# EAGLE design imu (EAGLE 6.5.0)
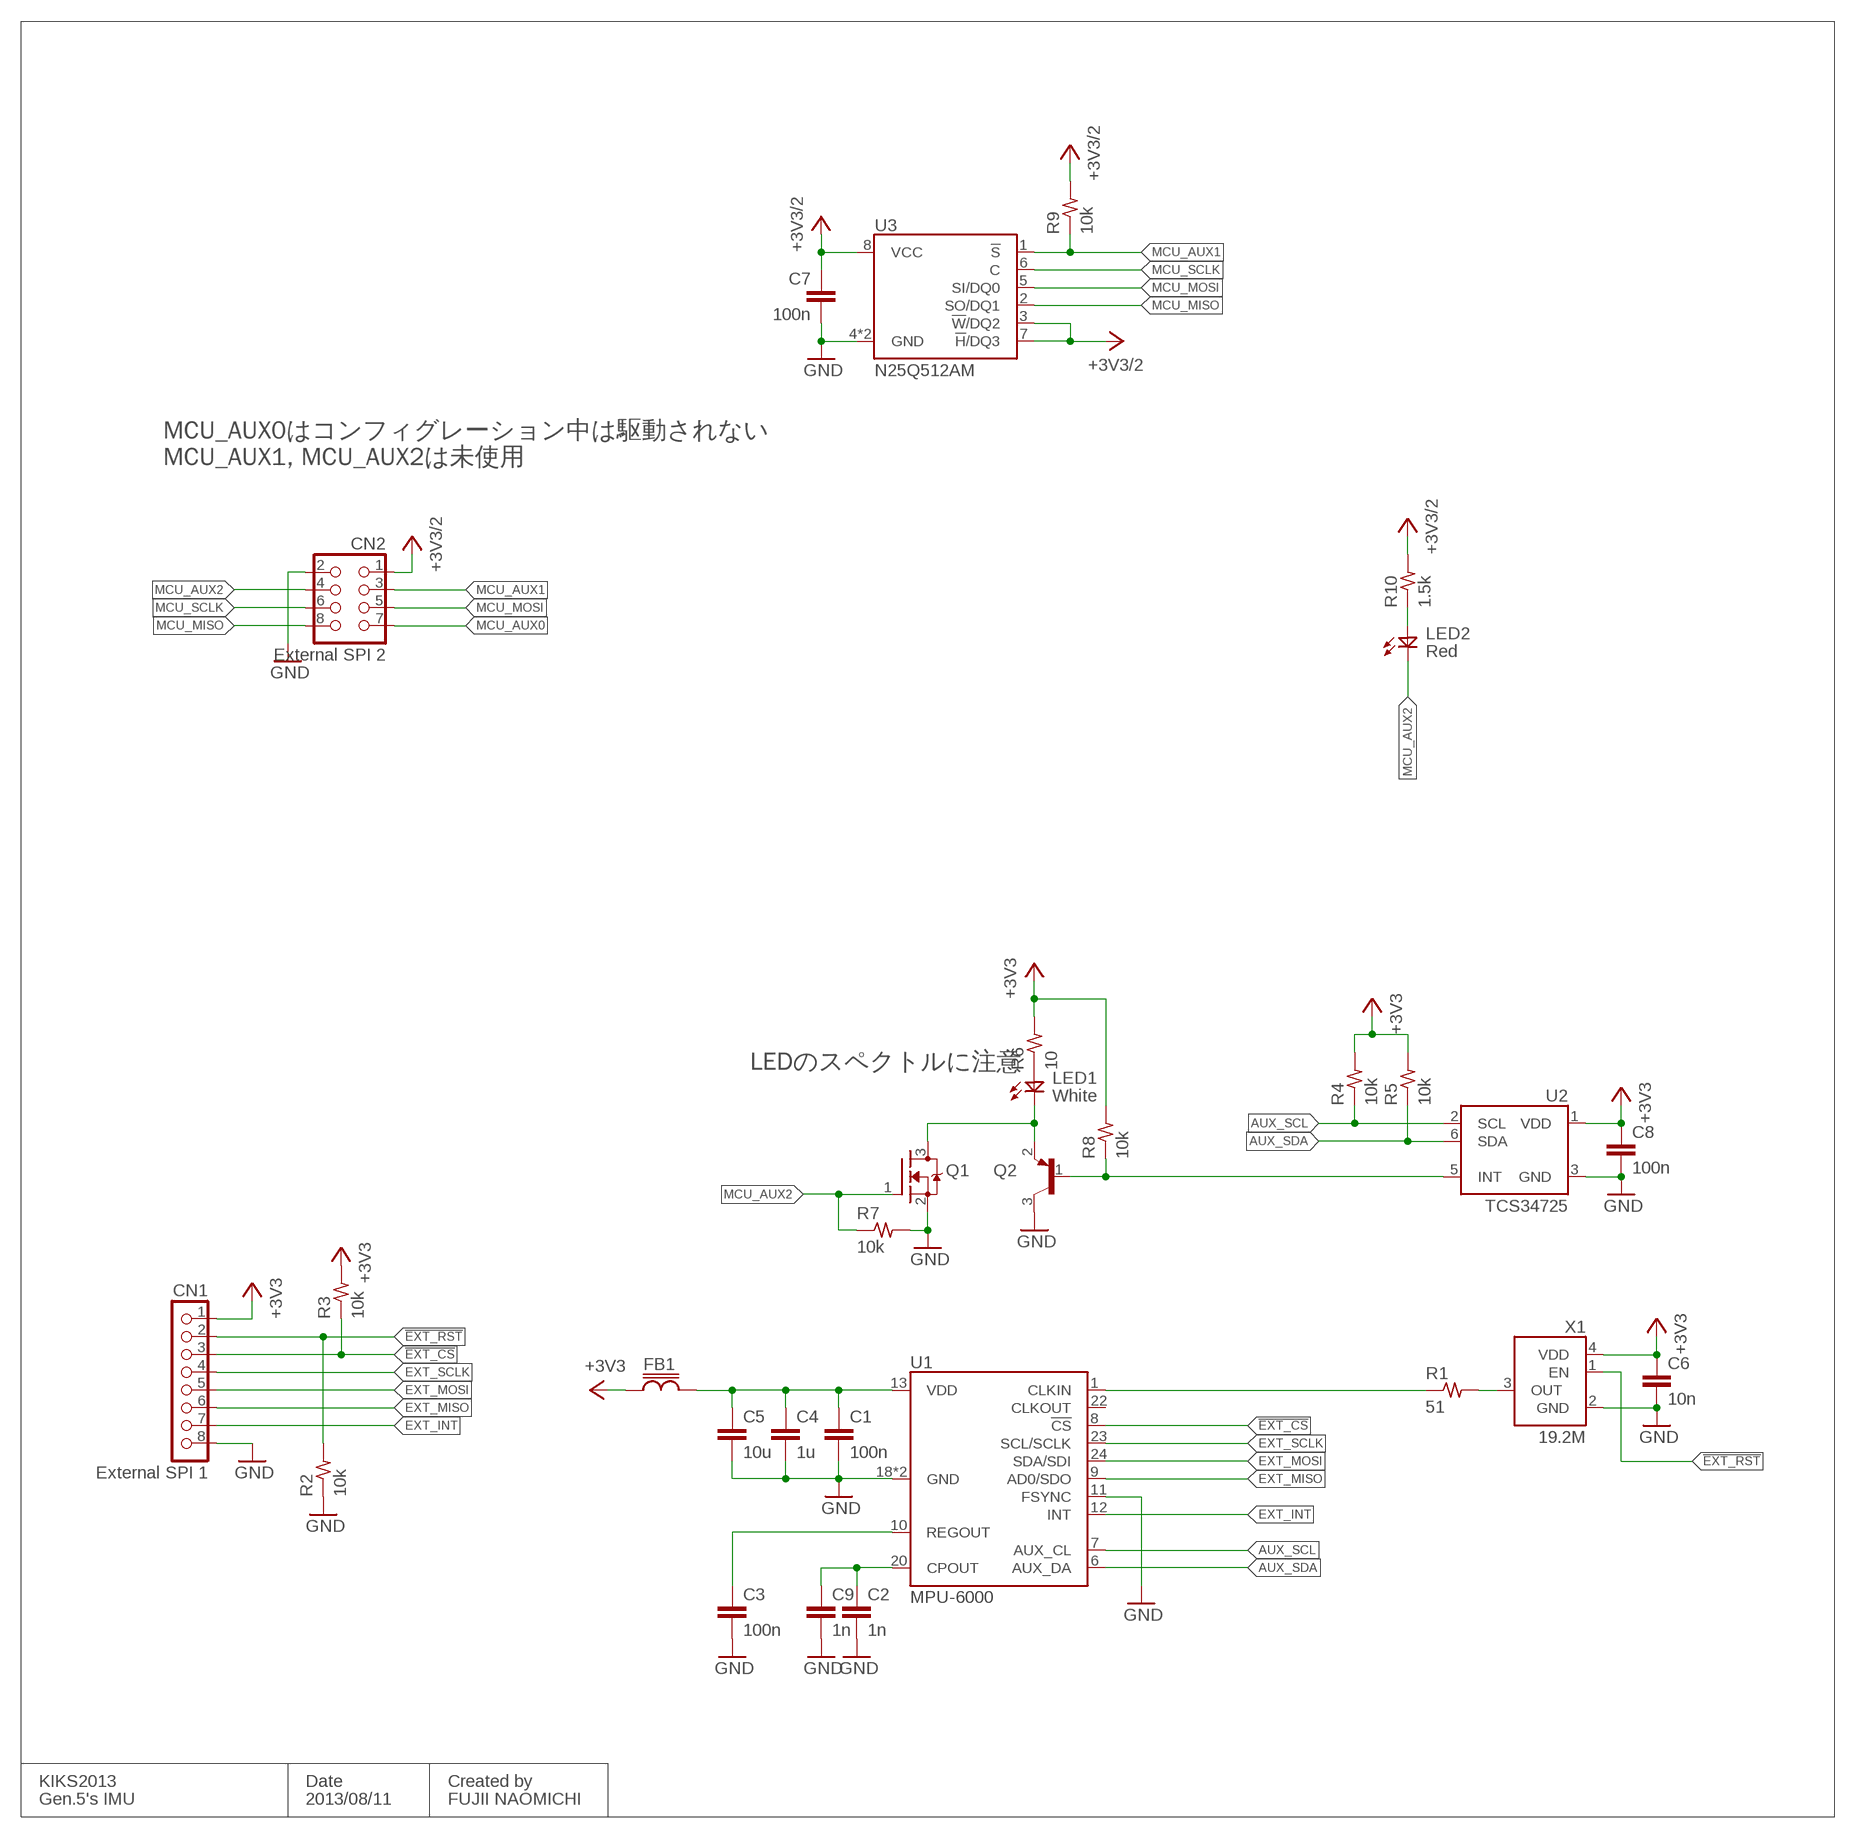
[diagram p0: schematic, sheet 1]

## Parts
C1  100n  C1005  [1005]
C2  1n  C1005  [1005]
C3  100n  C1005  [1005]
C4  1u  C1005  [1005]
C5  10u  C1005  [1005]
C6  10n  C1005  [1005]
C7  100n  C1005  [1005]
C8  100n  C1005  [1005]
C9  1n  C1005  [1005]
CN1  External SPI 1  PIN1X8  [PIN1X8]
CN2  External SPI 2  PIN2X4  [PIN2X4]
FB1  FB1608  [1608]
LED1  White  LED1608  [1608]
LED2  Red  LED1608  [1608]
Q1  MOS-N-SOT23  [SOT23-3]
Q2  PNP-SOT23  [SOT23-3]
R1  51  R1005  [1005]
R2  10k  R1005  [1005]
R3  10k  R1005  [1005]
R4  10k  R1005  [1005]
R5  10k  R1005  [1005]
R6  10  R1608  [1608]
R7  10k  R1005  [1005]
R8  10k  R1005  [1005]
R9  10k  R1005  [1005]
R10  1.5k  R1005  [1005]
U1  MPU-6000  [QFN24-0.5]
U2  TCS34725  [FN-6]
U3  N25Q512AM  [DFN8-1.27]
X1  19.2M  ASDMB  [OSC2520]

## Nets
!EXT_CS: CN1.3 R3.1 U1.8(!CS)
!EXT_RST: CN1.2 R2.2 X1.1(EN)
+3V3: C6.1 C8.1 CN1.1 FB1.1 R3.2 R4.2 R5.2 R6.2 R8.2 U2.1(VDD) X1.4(VDD)
+3V3/2: C7.1 CN2.1 R9.2 R10.2 U3.3(!W!/DQ2) U3.7(!H!/DQ3) U3.8(VCC)
AUX_SCL: R4.1 U1.7(AUX_CL) U2.2(SCL)
AUX_SDA: R5.1 U1.6(AUX_DA) U2.6(SDA)
EXT_INT: CN1.7 U1.12(INT)
EXT_MISO: CN1.6 U1.9(AD0/SDO)
EXT_MOSI: CN1.5 U1.24(SDA/SDI)
EXT_SCLK: CN1.4 U1.23(SCL/SCLK)
GND: C1.2 C2.2 C3.2 C4.2 C5.2 C6.2 C7.2 C8.2 C9.2 CN1.8 CN2.2 Q1.2(S) Q2.3(C) R2.1 R7.2 U1.11(FSYNC) U1.18(GND) U1.PAD(GND) U2.3(GND) U3.4(GND) U3.PAD(GND) X1.2(GND)
MCU_AUX0: CN2.7
MCU_AUX1: CN2.3 R9.1 U3.1(!S)
MCU_AUX2: CN2.4 LED2.K Q1.1(G) R7.1
MCU_MISO: CN2.8 U3.2(SO/DQ1)
MCU_MOSI: CN2.5 U3.5(SI/DQ0)
MCU_SCLK: CN2.6 U3.6(C)
N$1: C2.1 C9.1 U1.20(CPOUT)
N$2: C3.1 U1.10(REGOUT)
N$3: C1.1 C4.1 C5.1 FB1.2 U1.13(VDD)
N$4: R1.2 X1.3(OUT)
N$5: R1.1 U1.1(CLKIN)
N$6: LED1.A R6.1
N$7: Q2.1(B) R8.1 U2.5(INT)
N$8: LED1.K Q1.3(D) Q2.2(E)
N$9: LED2.A R10.1
Unconnected: U1.22(CLKOUT)

## Notes on the sheet
- MCU_AUX0はコンフィグレーション中は駆動されない
  MCU_AUX1, MCU_AUX2は未使用
- LEDのスペクトルに注意
- KIKS2013 | Date | Created by
- Gen.5's IMU | 2013/08/11 | FUJII NAOMICHI

## Library data of the parts
C1-C9 = Passive:C
CN1 = Connector:PIN1X8
CN2 = Connector:PIN2X4
FB1 = Passive:FB
LED1 LED2 = Opto:LED
Q1 = Transistor:MOS-N-*
Q2 = Transistor:PNP-
R1-R10 = Passive:R
U1 = ic-Invensense:MPU-6000
U2 = ic-ams:TCS3472; ADDRESS: 0x29; BUS: VDD
U3 = ic-Micron:N25Q512A
X1 = Oscillator:ASDM

## Board
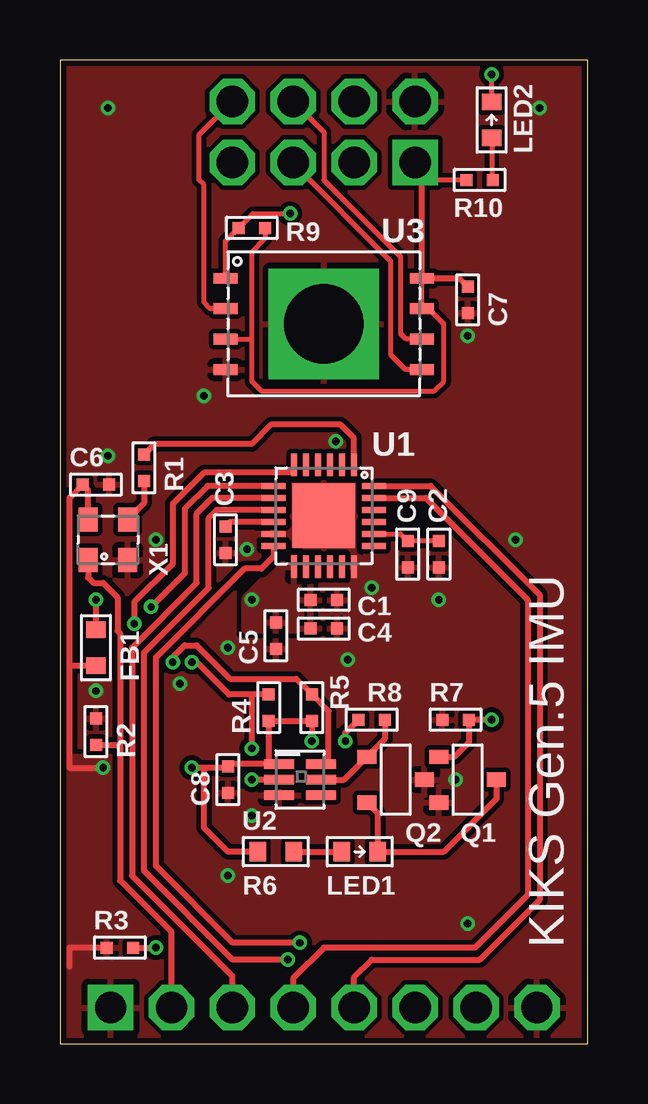
[diagram p1: board, top side]
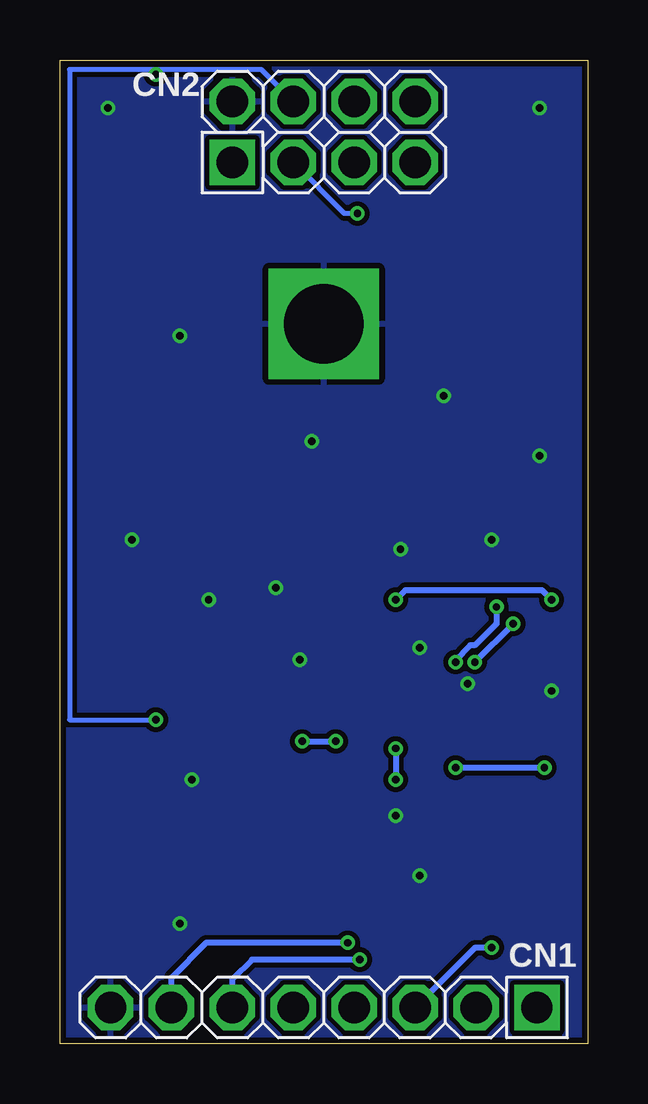
[diagram p2: board, bottom side, seen from below]

Size 22 x 41 mm. Coordinates in mm from the lower left corner, seen from the top.
Outline: 0,0 22,0 22,41 0,41 0,0
Copper layers (1*16): Top 0.035mm / dielectric 1.6mm / Bottom 0.035mm
Design rules "FusionPCB": minimum track width 6mil, minimum drill 0.3mm, track to track 6mil, track to pad 6mil, pad to pad 6mil, via to via 6mil, smd to smd 6mil, copper to edge 10mil, drill to drill 10mil, minimum pad ring 0.2mm, minimum via ring 6mil, stop-mask expansion 4mil, vias tented up to drill 3mm, thermal gap 10mil

### Footprints (pad centres in the part's own frame; a part is rotated, then mirrored left to right if it is on the bottom)
1005 = smd 0.5 x 0.5: 1 -0.55,0; 2 0.55,0
PIN1X8 = drill 1.3 pad 1.9 square: 1 -8.89,0 | drill 1.3 pad 1.9 octagon: 2 -6.35,0; 3 -3.81,0; 4 -1.27,0; 5 1.27,0; 6 3.81,0; 7 6.35,0; 8 8.89,0
PIN2X4 = drill 1.3 square: 1 -3.81,-1.27 | drill 1.3 octagon: 2 -3.81,1.27; 3 -1.27,-1.27; 4 -1.27,1.27; 5 1.27,-1.27; 6 1.27,1.27; 7 3.81,-1.27; 8 3.81,1.27
1608 = smd 0.7 x 0.8: 1 -0.75,0; 2 0.75,0
1608' = smd 0.7 x 0.8: A 0.75,0; K -0.75,0
SOT23-3 = smd 0.6 x 0.8: 1 -0.95,-1.2; 2 0.95,-1.2; 3 0,1.2
QFN24-0.5 = smd 0.95 x 0.25: 1 -2.125,1.25; 2 -2.125,0.75; 3 -2.125,0.25; 4 -2.125,-0.25; 5 -2.125,-0.75; 6 -2.125,-1.25; 13 2.125,-1.25; 14 2.125,-0.75; 15 2.125,-0.25; 16 2.125,0.25; 17 2.125,0.75; 18 2.125,1.25 | smd 0.25 x 1: 7 -1.25,-2.1; 8 -0.75,-2.1; 9 -0.25,-2.1; 10 0.25,-2.1; 11 0.75,-2.1; 12 1.25,-2.1; 19 1.25,2.1; 20 0.75,2.1; 21 0.25,2.1; 22 -0.25,2.1; 23 -0.75,2.1; 24 -1.25,2.1 | smd 2.7 x 2.6: PAD 0,0
FN-6 = smd 0.4 x 1.25: 1 -0.65,-0.875; 2 0,-0.875; 3 0.65,-0.875; 4 0.65,0.875; 5 0,0.875; 6 -0.65,0.875
DFN8-1.27 = smd 0.44 x 1: 1 -1.905,-4.1; 2 -0.635,-4.1; 3 0.635,-4.1; 4 1.905,-4.1; 5 1.905,4.1; 6 0.635,4.1; 7 -0.635,4.1; 8 -1.905,4.1 | drill 3.3 pad 4.6 square: PAD 0,0
OSC2520 = smd 0.8 x 1: 1 -0.825,-0.85; 2 0.825,-0.85; 3 0.825,0.85; 4 -0.825,0.85

### Placement (x,y rotation side)
C1  11,18.5 0 top
C2  15.8,20.4 270 top
C3  6.9,21 270 top
C4  11,17.3 0 top
C5  9,17 270 top
C6  1.5,23.3 0 top
C7  17,31 270 top
C8  7,11 270 top
C9  14.5,20.4 270 top
CN1  11,1.5 180 bottom
CN2  11,38 0 bottom
FB1  1.5,16.5 90 top
LED1  White  [1608']  12.5,8 180 top
LED2  Red  [1608']  18,38.5 270 top
Q1  17,11 270 top
Q2  14,11 270 top
R1  3.5,24 270 top
R2  1.5,13 270 top
R3  2.5,4 180 top
R4  8.7,14 270 top
R5  10.5,14 270 top
R6  9,8 180 top
R7  16.5,13.5 180 top
R8  13,13.5 180 top
R9  8,34 0 top
R10  17.5,36 180 top
U1  11,22 270 top
U2  10,11 270 top
U3  11,30 270 top
X1  2,21 0 top

### Tracks (layer width: path | path; a pad name or v marks a point on that pad's centre or on a via)
!EXT_CS  (via drill 0.3)
  Top 0.25: U1.8 6.35,22.75 5.7,22.1 5.7,19.2 3,16.5 3,7 7.19,2.81 CN1.3 | R3.1 v4,4
  Bottom 0.25: v4,4 4.69,4 CN1.3
!EXT_RST
  Top 0.25: 2.5,12.45 2.5,17.1 2.4,17.2 2.4,18.6 1.8,19.2 1.4,19.2 1.18,19.43 X1.1 | 2.5,12.45 2.5,6.8 4.65,4.65 CN1.2 | R2.2 2.5,12.45
+3V3  (via drill 0.3)
  Top 0.25: 0.4,3.21 0.4,4 R3.2 | 0.4,15.75 0.4,11.5 v1.8,11.5 | 0.4,15.75 0.4,22.75 C6.1 1.18,23.07 X1.4 | FB1.1 0.4,15.75 | 8.7,11.65 7.1,11.65 C8.1 6.95,11.5 6,11.5 | R6.2 7,8 6,9 6,11.5 | 8.7,11.65 R4.2 R5.2 v10.5,12.6 | 8.7,11.65 U2.1 | 6,11.5 v5.5,11.5 | v11.9,12.6 11.9,12.95 R8.2
  Bottom 0.25: v1.8,11.5 v5.5,11.5 | v11.9,12.6 v10.5,12.6
  pour Top (isolate 0.2): -3,12 3,12 3,8 5,6 5,-3 -3,-3
+3V3/2
  Top 0.2: U3.8 U3.7 15.37,30.64 16,30 16,27.6 15.6,27.2 8.4,27.2 8,27.6 8,29.36 | 8,29.36 8,33 8.55,33.55 R9.2 | U3.3 8,29.36 | R10.2 15.54,36 CN2.1
  Top 0.25: CN2.1 15.1,36.44 U3.8 16.64,31.91 C7.1
AUX_SCL  (via drill 0.3)
  Top 0.25: U1.7 6.15,23.25 5.2,22.3 5.2,19.6 v3.8,18.2 | 8.2,11 v8,11 U2.2 | v5.5,15.9 5.7,15.9 7.05,14.55 8,14.55 | R4.1 8,14.55 | v8,12.3 8,14.55
  Bottom 0.25: v3.8,18.2 3.8,17.5 4.7,16.6 4.9,16.6 5.5,16 v5.5,15.9 | v8,12.3 v8,11
AUX_SDA  (via drill 0.3)
  Top 0.25: U1.6 9.75,23.8 6,23.8 4.7,22.5 4.7,20 3.1,18.4 v3.1,17.5 | v4.7,15.9 4.7,16.1 5.2,16.6 5.7,16.6 7.1,15.2 9.85,15.2 R5.1 11.2,13.85 11.2,11.65 U2.6
  Bottom 0.25: v3.1,17.5 v4.7,15.9
EXT_INT  (via drill 0.3)
  Top 0.25: U1.12 8.9,20.3 8.4,19.8 7.7,19.8 4,16.1 4,7.4 7.2,4.2 v10,4.2
  Bottom 0.25: v10,4.2 15.9,4.2 17.35,2.75 CN1.7
EXT_MISO  (via drill 0.3)
  Top 0.25: U1.9 6.55,22.25 6.2,21.9 6.2,19 3.5,16.3 3.5,7.2 7.2,3.5 v9.5,3.5
  Bottom 0.25: v9.5,3.5 14,3.5 14.81,2.69 CN1.6
EXT_MOSI
  Top 0.25: U1.24 15.45,23.25 20,18.7 20,6 17.5,3.5 13,3.5 12.27,2.77 CN1.5
EXT_SCLK
  Top 0.25: U1.23 15.25,22.75 19.5,18.5 19.5,6.2 17.3,4 11,4 9.73,2.73 CN1.4
GND  (via drill 0.3)
  other vias: 7.8,20.6 13,19 12,16 15.8,18.5 4,21 5,15 7,16.5 17,5 8,9.5 19,21 16.5,11 2,24.5 20,39 11.5,25.1 17,29.5 2,39 6,27 1.5,14.7 7,7
  pour Top (isolate 0.2, rank 6): -1,42 23,42 23,-1 -1,-1
  pour Bottom (isolate 0.2, rank 6): -2,43 24,43 24,-2 -2,-2
  pour Top (isolate 0.25, rank 2, no thermals): 8,25 14,25 14,19 8,19
MCU_AUX1  (via drill 0.3)
  Top 0.2: U3.1 6.9,33.45 R9.1 8.05,34.6 v9.6,34.6
  Bottom 0.2: v9.6,34.6 10.14,34.6 CN2.3
MCU_AUX2  (via drill 0.3)
  Top 0.2: LED2.K v18,40.4
  Top 0.25: v18,13.5 R7.1 17.05,12.55 16.45,11.95 Q1.1
  Bottom 0.2: CN2.4 13.6,40.6 18,40.6 | 18,40.6 21.6,40.6 21.6,13.5 v18,13.5 | v18,40.4 18,40.6
MCU_MISO
  Top 0.2: U3.2 6.26,30.64 6,30.9 6,35.8 5.8,36 5.8,37.88 CN2.8
MCU_MOSI
  Top 0.2: CN2.5 9.73,36.67 13.8,32.6 13.8,28.7 14.4,28.09 U3.5
MCU_SCLK
  Top 0.2: CN2.6 11,38 11,36 14.2,32.8 14.2,29.6 14.44,29.36 U3.6
N$1
  Top 0.2: U1.20 14.2,21.25 C9.1 C2.1
N$2
  Top 0.25: U1.10 7.1,21.75 C3.1
N$3  (via drill 0.3)
  Top 0.25: FB1.2 v1.5,18.5
  Bottom 0.25: v8,18.5 7.6,18.9 1.9,18.9 v1.5,18.5
  pour Top (isolate 0.25): 10.8,20.8 10.8,17.2 7.7,17.2 7.7,18.6 9.9,20.8
N$4
  Top 0.25: R1.2 3.5,22.52 X1.3
N$5
  Top 0.25: U1.1 12.25,25.25 11.7,25.8 8.8,25.8 8,25 3.95,25 R1.1
N$6
  Top 0.25: R6.1 LED1.A
N$7
  Top 0.25: U2.5 11.85,11 Q2.1 13.55,12.7 R8.1
N$8
  Top 0.25: Q1.3 18.2,10.2 16,8 LED1.K 13.25,9.6 Q2.2
N$9
  Top 0.2: LED2.A 18,36.05 R10.1

### Text on the board
tPlace: KIKS Gen.5 IMU